# Altium schematic sheet 219-03-2268.SchDoc
size B; CompanyName: Microchip Technology Inc.; Organization: Microchip Technology; Address1: 2355 West Chandler Blvd.; Address2: Chandler, AZ  85224; Address4: USA; SheetNumber: 1; SheetTotal: 1; SheetTitle: **; Time: Time
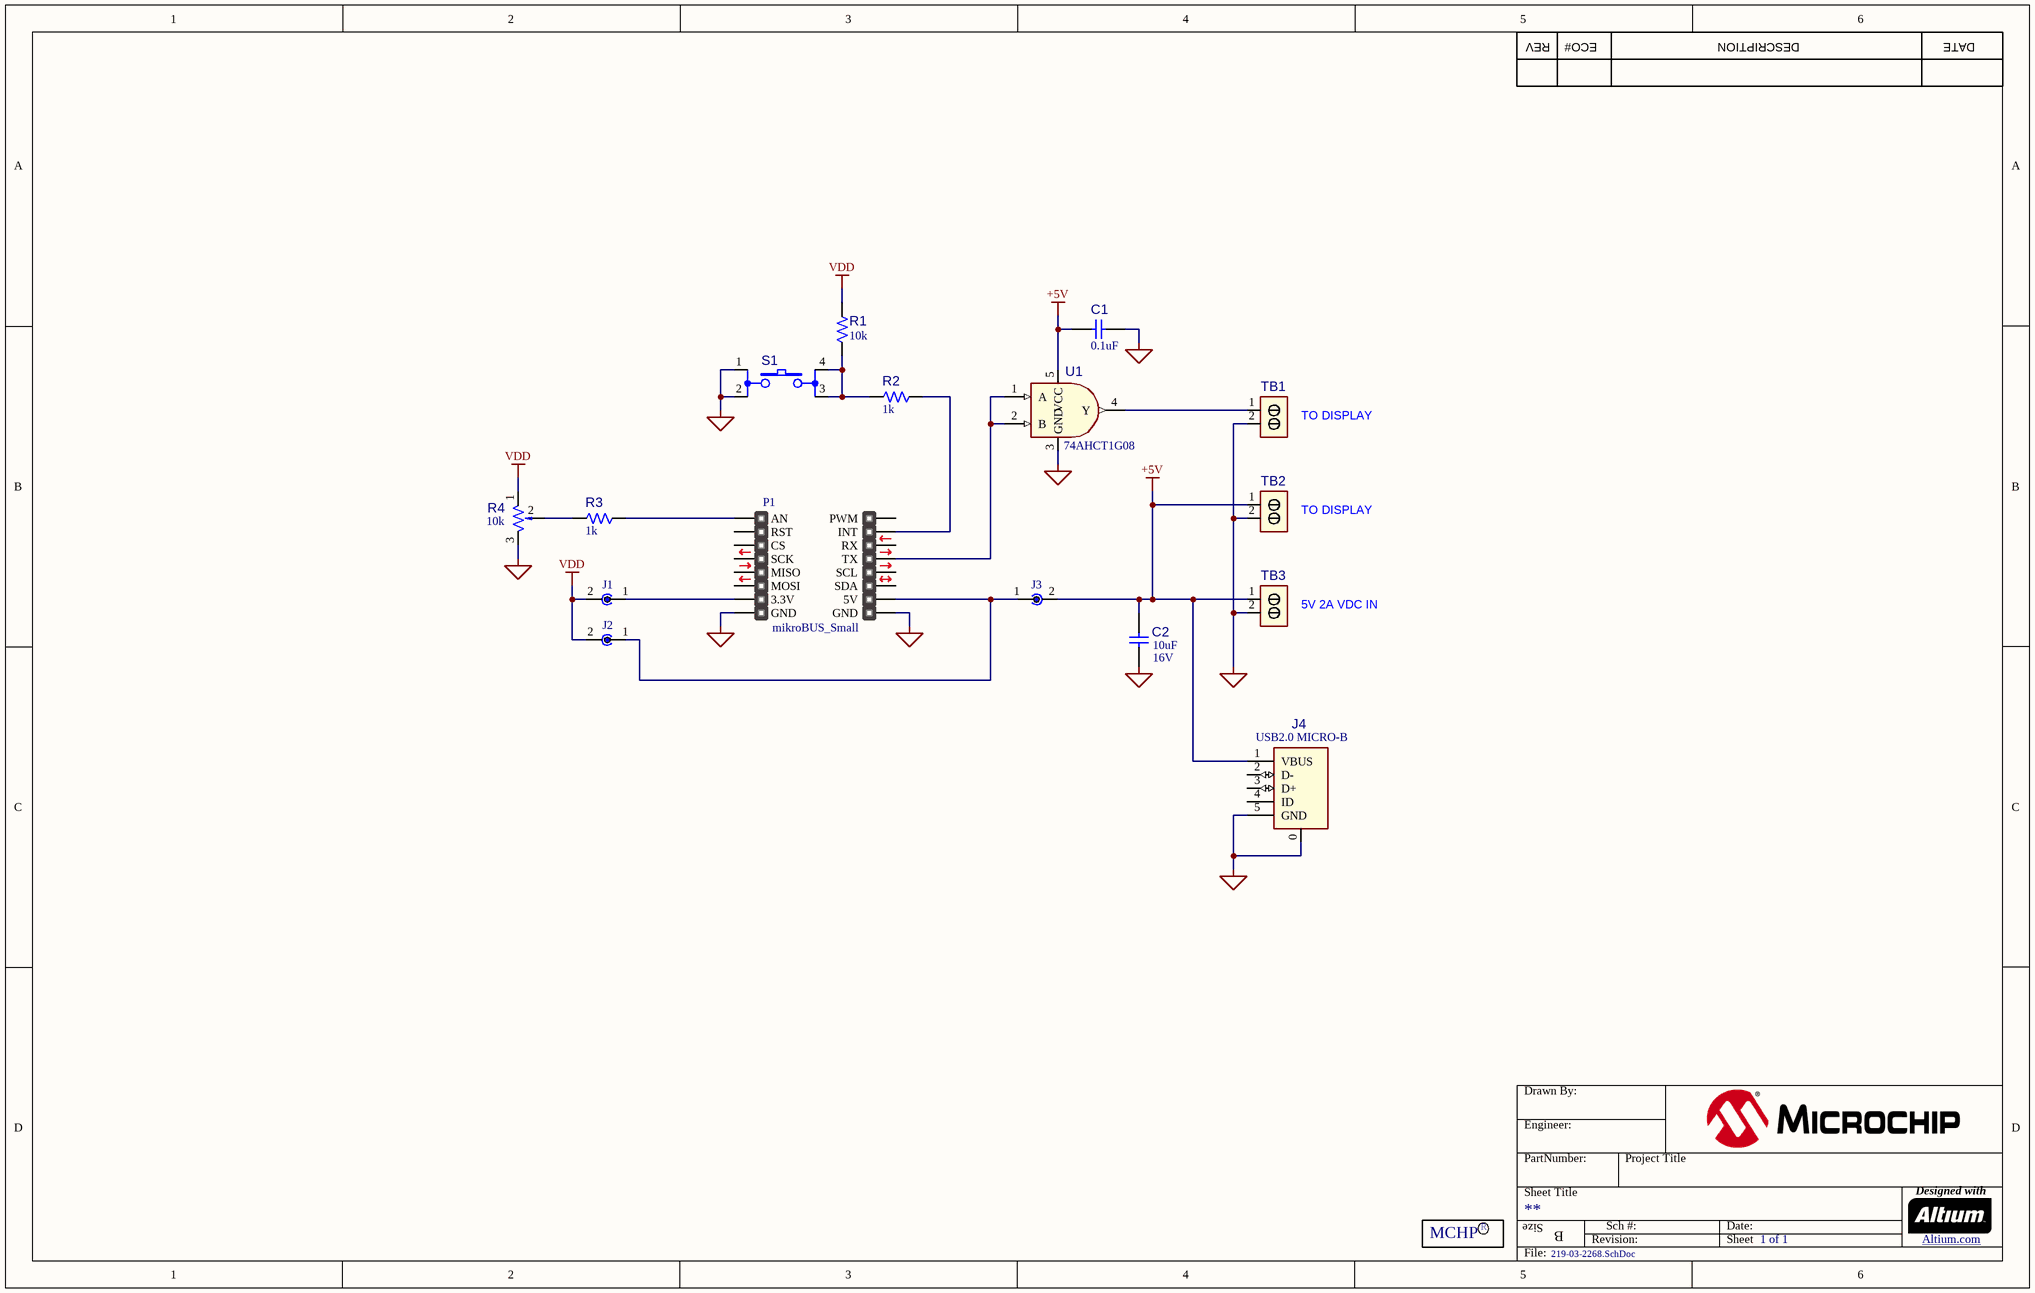
[diagram p0: 219-03-2268.SchDoc]

## Parts
?  (no value)  (graphical)
C1  value 0.1uF  [CAP_C_0603]  (hidden comment: Capacitor NP)
C2  value 10uF  Voltage: 16V  [CAP_C_1206]  (hidden comment: Capacitor NP)
J1  JMPR_Solder  [JMPR_SOLDER]  (value not drawn)  (no BOM)
J2  JMPR_Solder  [JMPR_SOLDER]  (value not drawn)  (no BOM)
J3  JMPR_Solder  [JMPR_SOLDER]  (value not drawn)  (no BOM)
J4  value USB2.0 MICRO-B  [CON_USB_Micro-AB_SMD_TH_RA_FCI_10118194-0001LF]  (hidden comment: CON USB2.0 Mini_Micro)
LOGO1  Logo_MCHP_Small  [LOGO_MCHP_SMALL]  (value not drawn)  (no BOM)
P1  value mikroBUS_Small  [MOD_mikroBUS_MINI]  (hidden comment: Module mikroBUS_Add-on_standard)
R1  value 10k  [RES_C_0603]  (hidden comment: Resistor)
R2  value 1k  [RES_C_0603]  (hidden comment: Resistor)
R3  value 1k  [RES_C_0603]  (hidden comment: Resistor)
R4  value 10k  [RES_VAR_TTE_72PTRxxKLF_KNOB_L9.53W9.53H10.15]  (hidden comment: Resistor Var)
S1  Switch 4 Pin  [SW_TACT_SMD_B3S-1000]  (value not drawn)
TB1  Header 1x2  [CON_TERMINAL_5_1x2_TH_RA_PHO_1935161]  (value not drawn)
TB2  Header 1x2  [CON_TERMINAL_5_1x2_TH_RA_PHO_1935161]  (value not drawn)
TB3  Header 1x2  [CON_TERMINAL_5_1x2_TH_RA_PHO_1935161]  (value not drawn)
U1  value 74AHCT1G08  [SOT-23-5]  (hidden comment: 74XX1G08_9 SOT-23-5)

## Nets
+5V: C1.1 C2.1 J3.2 J4.1(VBUS) TB2.1 TB3.1 U1.5(VCC)
GND: C1.2 C2.2 J4.0(SHLD) J4.5(GND) P1.8(GND) P1.9(GND) R4.3(CW) S1.1 S1.2 TB1.2 TB2.2 TB3.2 U1.3(GND)
VDD: J1.2 J2.2 R1.1 R4.1(CCW)
NetJ1_1: J1.1 P1.7(3.3V)
NetJ2_1: J2.1 J3.1 P1.10(5V)
NetP1_1: P1.1(AN) R3.2
NetP1_13: P1.13(TX) U1.1(A) U1.2(B)
NetP1_15: P1.15(INT) R2.2
NetR1_2: R1.2 R2.1 S1.3 S1.4
NetR3_1: R3.1 R4.2(Wiper)
NetTB1_1: TB1.1 U1.4(Y)

Not connected (* = marked no-connect by the designer): J4 2(D-) 3(D+) 4(ID); P1 2(RST) 3(CS) 4(SCK) 5(MISO) 6(MOSI) 11(SDA) 12(SCL) 14(RX) 16(PWM)

## Notes on the sheet
- REV
- ECO#
- DESCRIPTION
- DATE
- (near TB1) TO DISPLAY
- (near TB2) TO DISPLAY
- (near TB3) 5V 2A VDC IN
- Drawn By:
- Engineer:
- PartNumber:
- Project Title
- Sheet Title
- Size
- B
- Revision:
- Sch #:
- Date:
- Sheet
- Designed with
- Altium.com <http://go.altium.com/MicrochipLandingPage_Evaluation.html>
- File:
- (in symbol Logo_MCHP_Small) R; MCHP

## Library data of the parts
? = Title Block B
C1 = CAP0455: Capacitor; Manufacturer 1: AVX; Manufacturer Part Number 1: 06035G104ZAT2A; Voltage: 50V; Description_: CAP CER 0.1uF 50V 20% Y5V SMD 0603; Dev Tools Status: Production; Tolerance: 20%; Temperature Coeffcient: Y5V; Type: Ceramic; Populated: Yes; MCHP-ID: CAP0455; Package: 0603; Revision: 1; Symbol: Capacitor NP; Status: MCL Design; ComponentLink1URL: https://chn-vm-apps.microchip.com/mchprepo/parts/Datasheets/ECJ__General_.pdf; ComponentLink1Description: SVN Datasheet; ComponentLink2URL: C:\ALTIUM_WORK\00001_MCHP-CDB\Datasheets\ECJ__General_.pdf; ComponentLink2Description: Local Datasheet; ComponentLink3URL: C:\ALTIUM_WORK\00001_MCHP-CDB\Library\LibraryRefs\Capacitor NP.SchLib; ComponentLink3Description: Open Symbol; ComponentLink4URL: C:\ALTIUM_WORK\00001_MCHP-CDB\Library\Footprints\CAP_C_0603.PcbLib; ComponentLink4Description: Open Footprint; ComponentLink5Description: Open Footprint 2; ComponentLink6Description: Open Footprint 3; ComponentLink7Description: Open Footprint 4; Operating Temperature: -30C to +85C; Category: Capacitor; Manufacturer 2: Murata; Manufacturer Part Number 2: GRM188F51H104ZA01D; Manufacturer 3: Panasonic; Manufacturer Part Number 3: ECJ-1VF1H104Z; Manufacturer 4: TDK; Manufacturer Part Number 4: C1608Y5V1H104Z; Manufacturer 5: Yageo; Manufacturer Part Number 5: CC0603ZRY5V9BB104; Supplier 1: Digi-Key; Supplier Part Number 1: 478-3724-1-ND; Supplier 2: Digi-Key; Supplier Part Number 2: 490-1568-2-ND; Supplier 3: Digi-Key; Supplier Part Number 3: PCC2153CT-ND; Supplier 4: Digi-Key; Supplier Part Number 4: 445-1324-1-ND; Supplier 5: Digi-Key; Supplier Part Number 5: 311-1343-2-ND; Supplier 6: Digi-Key; Supplier Part Number 6: 311-1343-6-ND; Quantity Override: 1
C2 = CAP0623: Capacitor; Manufacturer 1: KEMET; Manufacturer Part Number 1: C1206C106K4PACTU; Description_: CAP CER 10uF 16V 10% X5R SMD 1206; Dev Tools Status: Production; Tolerance: 10%; Temperature Coeffcient: X5R; Type: Ceramic; Populated: Yes; MCHP-ID: CAP0623; Package: 1206; Revision: 1; Symbol: Capacitor NP; Status: MCL Design; ComponentLink1URL: https://chn-vm-apps.microchip.com/mchprepo/parts/Datasheets/general_B11.pdf; ComponentLink1Description: SVN Datasheet; ComponentLink2URL: C:\ALTIUM_WORK\00001_MCHP-CDB\Datasheets\general_B11.pdf; ComponentLink2Description: Local Datasheet; ComponentLink3URL: C:\ALTIUM_WORK\00001_MCHP-CDB\Library\LibraryRefs\Capacitor NP.SchLib; ComponentLink3Description: Open Symbol; ComponentLink4URL: C:\ALTIUM_WORK\00001_MCHP-CDB\Library\Footprints\CAP_C_1206.PcbLib; ComponentLink4Description: Open Footprint; ComponentLink5Description: Open Footprint 2; ComponentLink6Description: Open Footprint 3; ComponentLink7Description: Open Footprint 4; Operating Temperature: -55C to +85C; Category: Capacitor; Manufacturer 2: TDK; Manufacturer Part Number 2: C3216X5R1C106K; Manufacturer 3: AVX Corporation; Manufacturer Part Number 3: 1206YD106KAT2A; Supplier 1: Digi-Key; Supplier Part Number 1: 399-5091-1-ND; Supplier 2: Digi-Key; Supplier Part Number 2: 445-4052-1-ND; Supplier 3: Digi-Key; Supplier Part Number 3: 478-1573-1-ND; Quantity Override: 1
J1-J3 = JMPR_Solder: Jumper, Solder Blob Shorting
J4 = CON1383: Manufacturer 1: FCI; Manufacturer Part Number 1: 10118194-0001LF; Description_: CON USB2.0 MICRO-B FEMALE TH/SMD R/A; Dev Tools Status: Production; Owner: Jamus Griego; Populated: YES; MCHP-ID: CON1383; Revision: 1; Symbol: CON USB2.0 Mini_Micro; Status: MCL Design; ComponentLink1URL: https://chn-vm-apps.microchip.com/mchprepo/parts/Datasheets/10118194.pdf; ComponentLink1Description: SVN Datasheet; ComponentLink2URL: C:\ALTIUM_WORK\00001_MCHP-CDB\Datasheets\10118194.pdf; ComponentLink2Description: Local Datasheet; ComponentLink3URL: C:\ALTIUM_WORK\00001_MCHP-CDB\Library\LibraryRefs\CON USB2.0 Mini_Micro.SchLib; ComponentLink3Description: Open Symbol; ComponentLink4URL: C:\ALTIUM_WORK\00001_MCHP-CDB\Library\Footprints\CON_USB_Micro-AB_SMD_TH_RA_FCI_10118194-0001LF.PcbLib; ComponentLink4Description: Open Footprint; ComponentLink5Description: Open Footprint 2; ComponentLink6Description: Open Footprint 3; ComponentLink7Description: Open Footprint 4; Type: USB; Category: Connector; Manufacturer 2: YangMing; Manufacturer Part Number 2: YM-02-363-N05F; Supplier 1: Digi-Key; Supplier Part Number 1: 609-4618-1-ND; Supplier 2: Raynen; Supplier Part Number 2: YangMing YM-02-363-N05F; Quantity Override: 1
LOGO1 = Logo_MCHP_Small: Microchip Logo for PCB Silkscreen
P1 = CON1406: mikroBUS Target Header; Description_: Mikro BUS add-on Small Bd; Dev Tools Status: Design; Owner: Jose Garcia; Populated: YES; MCHP-ID: CON1406; Revision: 1; Symbol: Module mikroBUS_Add-on_standard; Status: MCL Design; ComponentLink1URL: https://chn-vm-apps.microchip.com/mchprepo/parts/Datasheets/mikrobus_specification_standard.pdf; ComponentLink1Description: SVN Datasheet; ComponentLink2URL: C:\ALTIUM_WORK\00001_MCHP-CDB\Datasheets\mikrobus_specification_standard.pdf; ComponentLink2Description: Local Datasheet; ComponentLink3URL: C:\ALTIUM_WORK\00001_MCHP-CDB\Library\LibraryRefs\Module mikroBUS_Add-on_standard.SchLib; ComponentLink3Description: Open Symbol; ComponentLink4URL: C:\ALTIUM_WORK\00001_MCHP-CDB\Library\Footprints\MOD_mikroBUS_MINI.PcbLib; ComponentLink4Description: Open Footprint; ComponentLink5Description: Open Footprint 2; ComponentLink6Description: Open Footprint 3; ComponentLink7Description: Open Footprint 4; Type: Modular; Category: Connector; Quantity Override: 1
R1 = RSMT0139: Manufacturer 1: Panasonic; Manufacturer Part Number 1: ERJ-3EKF1002V; Tolerance: 1%; Description_: RES TKF 10k 1% 1/10W SMD 0603; Dev Tools Status: Production; Temperature Coeffcient: 100ppm/C; Power: 1/10W; Populated: Yes; MCHP-ID: RSMT0139; Package: 0603; Revision: 2; Symbol: Resistor; Status: MCL Design; ComponentLink1URL: https://chn-vm-apps.microchip.com/mchprepo/parts/Datasheets/nrc.pdf; ComponentLink1Description: SVN Datasheet; ComponentLink2URL: C:\ALTIUM_WORK\00001_MCHP-CDB\Datasheets\nrc.pdf; ComponentLink2Description: Local Datasheet; ComponentLink3URL: C:\ALTIUM_WORK\00001_MCHP-CDB\Library\LibraryRefs\Resistor.SchLib; ComponentLink3Description: Open Symbol; ComponentLink4URL: C:\ALTIUM_WORK\00001_MCHP-CDB\Library\Footprints\RES_C_0603.PcbLib; ComponentLink4Description: Open Footprint; ComponentLink5Description: Open Footprint 2; ComponentLink6Description: Open Footprint 3; ComponentLink7Description: Open Footprint 4; Operating Temperature: -55C to +155C; Category: Resistor; Type: RES SMD; Composition: TKF; Manufacturer 2: Stackpole Electronics Inc; Manufacturer Part Number 2: RMCF0603FT10K0; Manufacturer 3: Stackpole Electronics Inc; Manufacturer Part Number 3: RMCF 1/16 10K 1% R; Manufacturer 4: Yageo; Manufacturer Part Number 4: RC0603FR-0710KL; Manufacturer 5: Xicon; Manufacturer Part Number 5: 302-10K-RC; Manufacturer 6: NIC Components; Manufacturer Part Number 6: NRC06F1002TRF; Supplier 1: Digi-Key; Supplier Part Number 1: P10.0KHCT-ND; Supplier 2: Digi-Key; Supplier Part Number 2: RMCF1/1610KFRTR-ND; Supplier 3: Digi-Key; Supplier Part Number 3: RMCF0603FT10K0TR-ND; Supplier 4: Digi-Key; Supplier Part Number 4: 311-10.0KHRCT-ND; Supplier 5: Mouser; Supplier Part Number 5: 302-10k-RC; Supplier 6: NIC Components; Supplier Part Number 6: NRC06F1002TRF; Quantity Override: 1
R2 R3 = RSMT0138: Manufacturer 1: Panasonic; Manufacturer Part Number 1: ERJ-3EKF1001V; Tolerance: 1%; Description_: RES TKF 1k 1% 1/10W SMD 0603; Dev Tools Status: Production; Voltage: 75V; Temperature Coeffcient: 100ppm/C; Power: 1/10W; Populated: Yes; MCHP-ID: RSMT0138; Package: 0603; Revision: 2; Symbol: Resistor; Status: MCL Design; ComponentLink1URL: https://chn-vm-apps.microchip.com/mchprepo/parts/Datasheets/AOA0000CE2.pdf; ComponentLink1Description: SVN Datasheet; ComponentLink2URL: C:\ALTIUM_WORK\00001_MCHP-CDB\Datasheets\AOA0000CE2.pdf; ComponentLink2Description: Local Datasheet; ComponentLink3URL: C:\ALTIUM_WORK\00001_MCHP-CDB\Library\LibraryRefs\Resistor.SchLib; ComponentLink3Description: Open Symbol; ComponentLink4URL: C:\ALTIUM_WORK\00001_MCHP-CDB\Library\Footprints\RES_C_0603.PcbLib; ComponentLink4Description: Open Footprint; ComponentLink5Description: Open Footprint 2; ComponentLink6Description: Open Footprint 3; ComponentLink7Description: Open Footprint 4; Operating Temperature: -55C to +155C; Category: Resistor; Type: RES SMD; Composition: TKF; Manufacturer 2: ROHM; Manufacturer Part Number 2: MCR03EZPFX1001; Manufacturer 3: Stackpole Electronics Inc; Manufacturer Part Number 3: RMCF0603FT1K00; Manufacturer 4: Stackpole Electronics Inc; Manufacturer Part Number 4: RMCF 1/16 1K 1% R; Manufacturer 5: Vishay; Manufacturer Part Number 5: CRCW06031K00FKEA; Manufacturer 6: Stackpole Electronics Inc; Manufacturer Part Number 6: RMCF1/161.0K1%TR; Manufacturer 7: Yageo; Manufacturer Part Number 7: RC0603FR-071KL; Manufacturer 8: TE Connectivity; Manufacturer Part Number 8: 1622866-1; Supplier 1: Digi-Key; Supplier Part Number 1: P1.00KHCT-ND; Supplier 2: Digi-Key; Supplier Part Number 2: P1.00KHTR-ND; Supplier 3: Digi-Key; Supplier Part Number 3: RHM1.00KHCT-ND; Supplier 4: Digi-Key; Supplier Part Number 4: RMCF1/161KFRTR-ND; Supplier 5: Digi-Key; Supplier Part Number 5: RMCF0603FT1K00TR-ND; Supplier 6: Newark; Supplier Part Number 6: 52K8015; Supplier 7: Stackpole Electronics Inc; Supplier Part Number 7: RMCF1/161.0K1%TR; Supplier 8: Digi-Key; Supplier Part Number 8: 311-1.00KHRCT-ND; Supplier 9: Digi-Key; Supplier Part Number 9: A106049CT-ND; Quantity Override: 1
R4 = RES1583: Manufacturer 1: TT Electronics/BI                                                                               TT Electronics/BI; Manufacturer Part Number 1: 72PTR10KLF; Tolerance: 10%; Description_: RES VARIABLE C 10K 10% 1/2W TH 72PTR10KLF Knob; Dev Tools Status: Production; Power: 1/2W; Owner: Mark Loper; Populated: YES; MCHP-ID: RES1583; Revision: 1; Symbol: Resistor VAR; Status: MCL Design; ComponentLink1URL: https://chn-vm-apps.microchip.com/mchprepo/parts/Datasheets/Datasheet; ComponentLink1Description: SVN Datasheet; ComponentLink2URL: C:\ALTIUM_WORK\00001_MCHP-CDB\Datasheets\Datasheet; ComponentLink2Description: Local Datasheet; ComponentLink3URL: C:\ALTIUM_WORK\00001_MCHP-CDB\Library\LibraryRefs\Resistor VAR.SchLib; ComponentLink3Description: Open Symbol; ComponentLink4URL: C:\ALTIUM_WORK\00001_MCHP-CDB\Library\Footprints\RES_VAR_TTE_72PTRxxKLF_KNOB_L9.53W9.53H10.15.PcbLib; ComponentLink4Description: Open Footprint; ComponentLink5Description: Open Footprint 2; ComponentLink6Description: Open Footprint 3; ComponentLink7Description: Open Footprint 4; Category: Resistor; Type: Trimmer; Supplier 1: Digi-Key; Supplier Part Number 1: 987-1534-ND; Quantity Override: 1
S1 = SWITCH1046: Switch; Manufacturer 1: Wurth Electronics Inc; Manufacturer Part Number 1: 430182043816; Value: PTS645SM43SMTR92 LFS; Description_: SWITCH TACT SPST 12V 50mA PTS645SM43SMTR92 LFS SMD; Dev Tools Status: Production; Owner: Jamus Griego; Populated: YES; MCHP-ID: SWITCH1046; Revision: 1; Symbol: Switch 4 Pin; Status: MCL Design; ComponentLink1URL: https://chn-vm-apps.microchip.com/mchprepo/parts/Datasheets/PTS645_17dec14.pdf; ComponentLink1Description: SVN Datasheet; ComponentLink2URL: C:\ALTIUM_WORK\00001_MCHP-CDB\Datasheets\PTS645_17dec14.pdf; ComponentLink2Description: Local Datasheet; ComponentLink3URL: C:\ALTIUM_WORK\00001_MCHP-CDB\Library\LibraryRefs\Switch 4 Pin.SchLib; ComponentLink3Description: Open Symbol; ComponentLink4URL: C:\ALTIUM_WORK\00001_MCHP-CDB\Library\Footprints\SW_TACT_SMD_B3S-1000.PcbLib; ComponentLink4Description: Open Footprint; ComponentLink5Description: Open Footprint 2; ComponentLink6Description: Open Footprint 3; ComponentLink7Description: Open Footprint 4; Category: Switch; Type: Tactile; Manufacturer 2: C&K Components; Manufacturer Part Number 2: PTS645SM43SMTR92 LFS; Manufacturer 3: SWITECH; Manufacturer Part Number 3: TS2A-043C-G9; Supplier 1: Digi-Key; Supplier Part Number 1: 732-7004-1-ND; Supplier 2: Digi-Key; Supplier Part Number 2: CKN9112CT-ND; Supplier 3: Raynen; Supplier Part Number 3: SWITECH TS2A-043C-G9; Quantity Override: 1
TB1-TB3 = CON0287: Manufacturer 1: Phoenix Contact; Manufacturer Part Number 1: 1935161; Value: TERMINAL 1x2; Description_: CON TERMINAL 5mm 1x2 Female 12-26AWG 18A TH R/A; Dev Tools Status: Production; Owner: Stephen Humberd; Voltage: 300V; Current: 18A; Populated: YES; MCHP-ID: CON0287; Revision: 1; Symbol: Header 1x2; Status: MCL Design; ComponentLink1URL: https://chn-vm-apps.microchip.com/mchprepo/parts/Datasheets/1935161.pdf; ComponentLink1Description: SVN Datasheet; ComponentLink2URL: C:\ALTIUM_WORK\00001_MCHP-CDB\Datasheets\1935161.pdf; ComponentLink2Description: Local Datasheet; ComponentLink3URL: C:\ALTIUM_WORK\00001_MCHP-CDB\Library\LibraryRefs\Header 1x2.SchLib; ComponentLink3Description: Open Symbol; ComponentLink4URL: C:\ALTIUM_WORK\00001_MCHP-CDB\Library\Footprints\CON_TERMINAL_5_1x2_TH_RA_PHO_1935161.PcbLib; ComponentLink4Description: Open Footprint; ComponentLink5Description: Open Footprint 2; ComponentLink6Description: Open Footprint 3; ComponentLink7Description: Open Footprint 4; Type: Terminal Block; Category: Connector; Supplier 1: Digi-Key; Supplier Part Number 1: 277-1667-ND; Quantity Override: 1
U1 = IC00097: Gate AND; Manufacturer 1: Texas Instruments; Manufacturer Part Number 1: SN74AHCT1G08DBVR; Description_: IC LOGIC 74AHCT1G08 SINGLE 2-INPUT AND GATE SOT-23-5; Dev Tools Status: Production; Populated: YES; MCHP-ID: IC00097; Revision: 1; Symbol: 74XX1G08_9 SOT-23-5; Status: MCL Design; Package: SOT-23-5; ComponentLink1URL: https://chn-vm-apps.microchip.com/mchprepo/parts/Datasheets/sn74ahct1g08.pdf; ComponentLink1Description: SVN Datasheet; ComponentLink2URL: C:\ALTIUM_WORK\00001_MCHP-CDB\Datasheets\sn74ahct1g08.pdf; ComponentLink2Description: Local Datasheet; ComponentLink3URL: C:\ALTIUM_WORK\00001_MCHP-CDB\Library\LibraryRefs\74XX1G08_9 SOT-23-5.SchLib; ComponentLink3Description: Open Symbol; ComponentLink4URL: C:\ALTIUM_WORK\00001_MCHP-CDB\Library\Footprints\SOT-23-5.PcbLib; ComponentLink4Description: Open Footprint; ComponentLink5Description: Open Footprint 2; ComponentLink6Description: Open Footprint 3; ComponentLink7Description: Open Footprint 4; Operating Temperature: -40C to +85C; Type: Logic; Category: IC; Supplier 1: Digi-Key; Supplier Part Number 1: 296-1113-1-ND; Quantity Override: 1